# EAGLE schematic analogue-board (EAGLE 7.7.0)

## Sheet 1 of 2
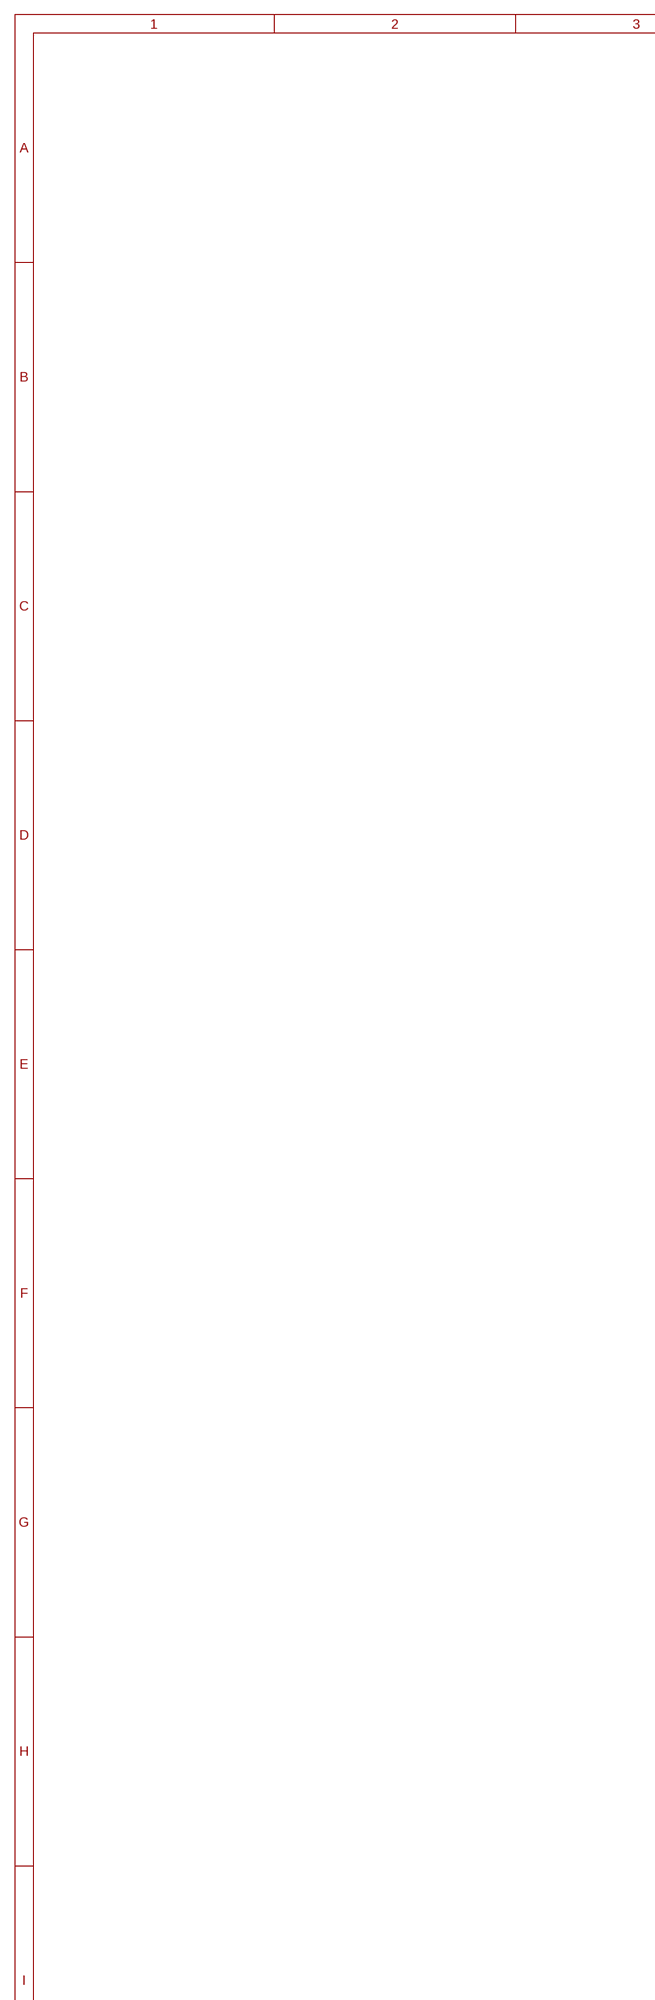
[diagram p0: schematic, sheet 1, part 1 of 2]
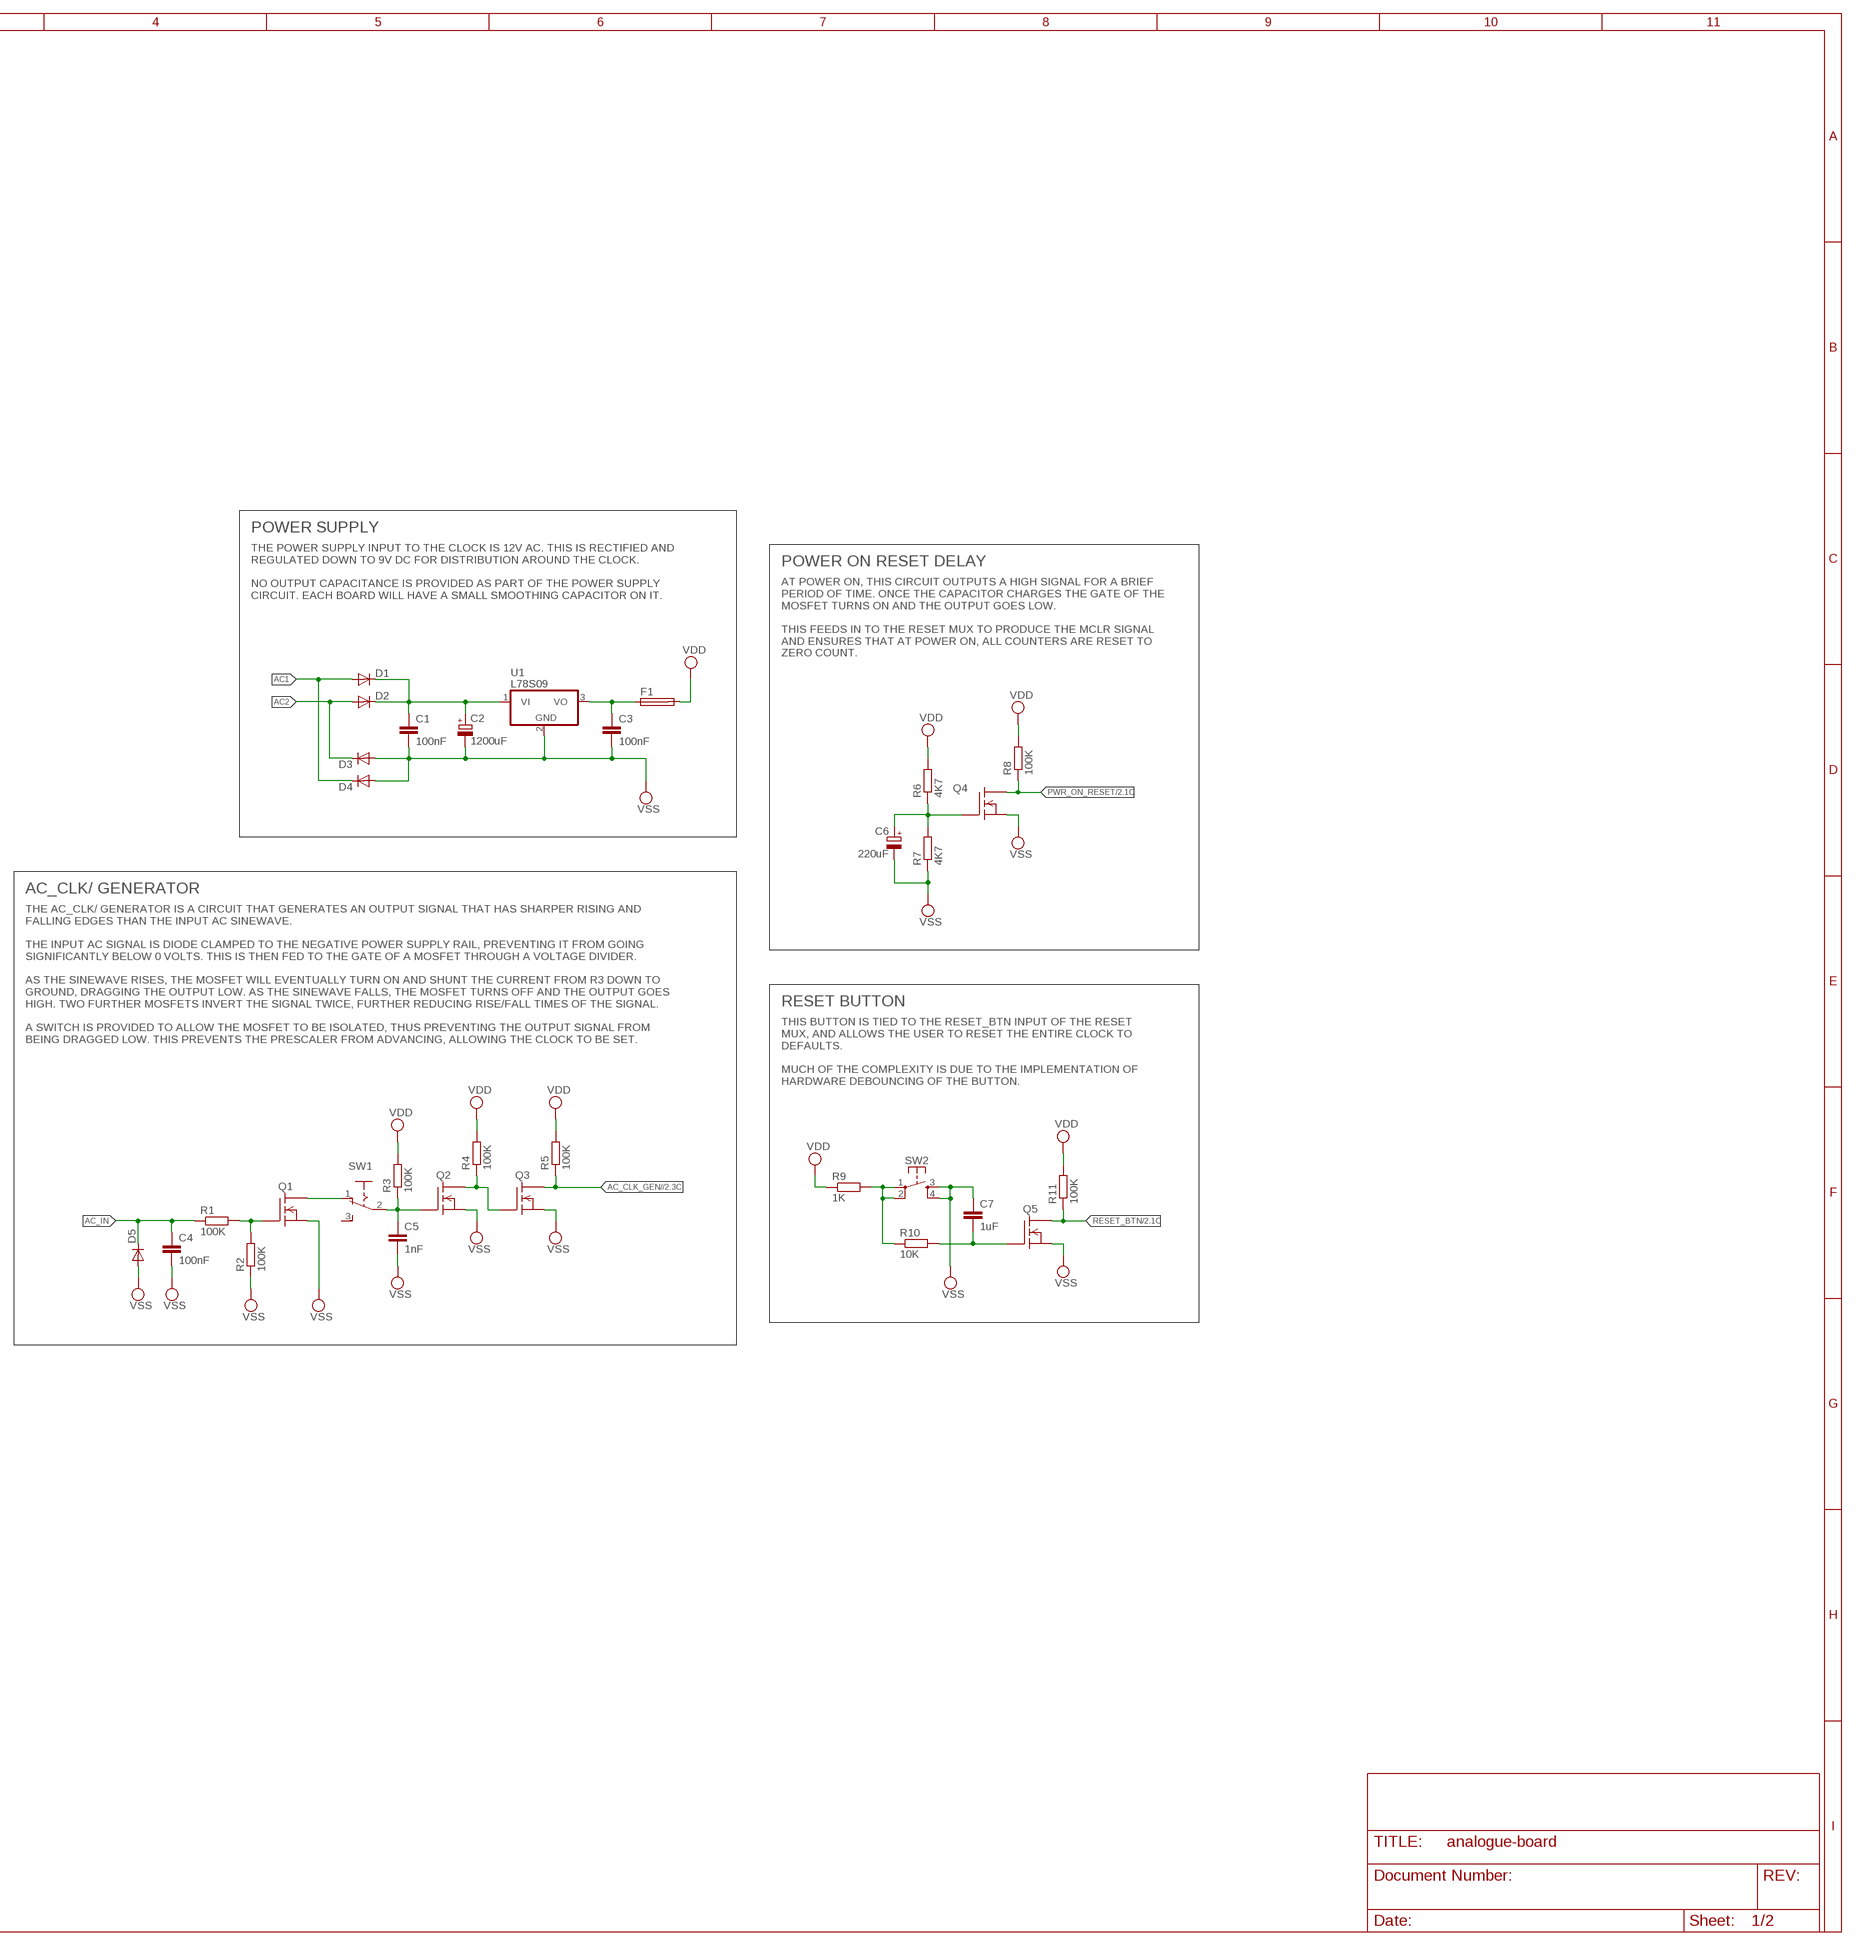
[diagram p1: schematic, sheet 1, part 2 of 2]

### Parts
C1  100nF  C-EU050-024X044  [C050-024X044]
C2  1200uF  CPOL-EUE7.5-16  [E7,5-16]
C3  100nF  C-EU050-024X044  [C050-024X044]
C4  100nF  C-EU050-024X044  [C050-024X044]
C5  1nF  C-EU050-025X075  [C050-025X075]
C6  220uF  CPOL-EUE2.5-6  [E2,5-6]
C7  1uF  C-EU050-025X075  [C050-025X075]
D1  1N4004  [DO41-10]
D2  1N4004  [DO41-10]
D3  1N4004  [DO41-10]
D4  1N4004  [DO41-10]
D5  1N4004  [DO41-10]
F1  TE5  [TE5]
Q1  2N7000  [TO-92]
Q2  2N7000  [TO-92]
Q3  2N7000  [TO-92]
Q4  2N7000  [TO-92]
Q5  2N7000  [TO-92]
R1  100K  R-EU_0207/2V  [0207/2V]
R2  100K  R-EU_0207/2V  [0207/2V]
R3  100K  R-EU_0207/2V  [0207/2V]
R4  100K  R-EU_0207/2V  [0207/2V]
R5  100K  R-EU_0207/2V  [0207/2V]
R6  4K7  R-EU_0207/2V  [0207/2V]
R7  4K7  R-EU_0207/2V  [0207/2V]
R8  100K  R-EU_0207/2V  [0207/2V]
R9  1K  R-EU_0207/2V  [0207/2V]
R10  10K  R-EU_0207/2V  [0207/2V]
R11  100K  R-EU_0207/2V  [0207/2V]
SW1  255SB  [255SB]
SW2  SPST-TACSWITCH  [TE-SMD-TACSWITCH]
U1  L78S09  7805T  [TO220H]

### Nets
AC1: D1.A D4.C
AC2: D2.A D3.C
AC_CLK_GEN/: Q3.3(D) R5.1 ; also sheet 2
AC_IN: C4.1 D5.C R1.1
N$1: C5.1 Q2.2(G) R3.1 SW1.2(P)
N$3: C6.+ Q4.2(G) R6.1 R7.2
N$4: C3.1 F1.1 U1.3(VO)
N$11: C1.1 C2.+ D1.C D2.C U1.1(VI)
N$12: R9.2 R10.1 SW2.1 SW2.2
N$13: Q2.3(D) Q3.2(G) R4.1
N$14: Q1.2(G) R1.2 R2.2
N$15: C7.2 Q5.2(G) R10.2
N$16: Q1.3(D) SW1.1(O)
PWR_ON_RESET: Q4.3(D) R8.1 ; also sheet 2
RESET_BTN: Q5.3(D) R11.1 ; also sheet 2
VDD: F1.2 R3.2 R4.2 R5.2 R6.2 R8.2 R9.1 R11.2 ; also sheet 2
VSS: C1.2 C2.- C3.2 C4.2 C5.2 C6.- C7.1 D3.A D4.A D5.A Q1.1(S) Q2.1(S) Q3.1(S) Q4.1(S) Q5.1(S) R2.1 R7.1 SW2.3 SW2.4 U1.2(GND) ; also sheet 2
Unconnected: SW1.3(S)

### Notes on the sheet
- POWER SUPPLY
- THE POWER SUPPLY INPUT TO THE CLOCK IS 12V AC. THIS IS RECTIFIED AND
  REGULATED DOWN TO 9V DC FOR DISTRIBUTION AROUND THE CLOCK.
  
  NO OUTPUT CAPACITANCE IS PROVIDED AS PART OF THE POWER SUPPLY
  CIRCUIT. EACH BOARD WILL HAVE A SMALL SMOOTHING CAPACITOR ON IT.
- POWER ON RESET DELAY
- AT POWER ON, THIS CIRCUIT OUTPUTS A HIGH SIGNAL FOR A BRIEF
  PERIOD OF TIME. ONCE THE CAPACITOR CHARGES THE GATE OF THE
  MOSFET TURNS ON AND THE OUTPUT GOES LOW.
  
  THIS FEEDS IN TO THE RESET MUX TO PRODUCE THE MCLR SIGNAL
  AND ENSURES THAT AT POWER ON, ALL COUNTERS ARE RESET TO
  ZERO COUNT.
- AC_CLK/ GENERATOR
- THE AC_CLK/ GENERATOR IS A CIRCUIT THAT GENERATES AN OUTPUT SIGNAL THAT HAS SHARPER RISING AND
  FALLING EDGES THAN THE INPUT AC SINEWAVE.
  
  THE INPUT AC SIGNAL IS DIODE CLAMPED TO THE NEGATIVE POWER SUPPLY RAIL, PREVENTING IT FROM GOING
  SIGNIFICANTLY BELOW 0 VOLTS. THIS IS THEN FED TO THE GATE OF A MOSFET THROUGH A VOLTAGE DIVIDER.
  
  AS THE SINEWAVE RISES, THE MOSFET WILL EVENTUALLY TURN ON AND SHUNT THE CURRENT FROM R3 DOWN TO
  GROUND, DRAGGING THE OUTPUT LOW. AS THE SINEWAVE FALLS, THE MOSFET TURNS OFF AND THE OUTPUT GOES
  HIGH. TWO FURTHER MOSFETS INVERT THE SIGNAL TWICE, FURTHER REDUCING RISE/FALL TIMES OF THE SIGNAL.
  
  A SWITCH IS PROVIDED TO ALLOW THE MOSFET TO BE ISOLATED, THUS PREVENTING THE OUTPUT SIGNAL FROM
  BEING DRAGGED LOW. THIS PREVENTS THE PRESCALER FROM ADVANCING, ALLOWING THE CLOCK TO BE SET.
- RESET BUTTON
- THIS BUTTON IS TIED TO THE RESET_BTN INPUT OF THE RESET
  MUX, AND ALLOWS THE USER TO RESET THE ENTIRE CLOCK TO
  DEFAULTS.
  
  MUCH OF THE COMPLEXITY IS DUE TO THE IMPLEMENTATION OF
  HARDWARE DEBOUNCING OF THE BUTTON.

## Sheet 2 of 2
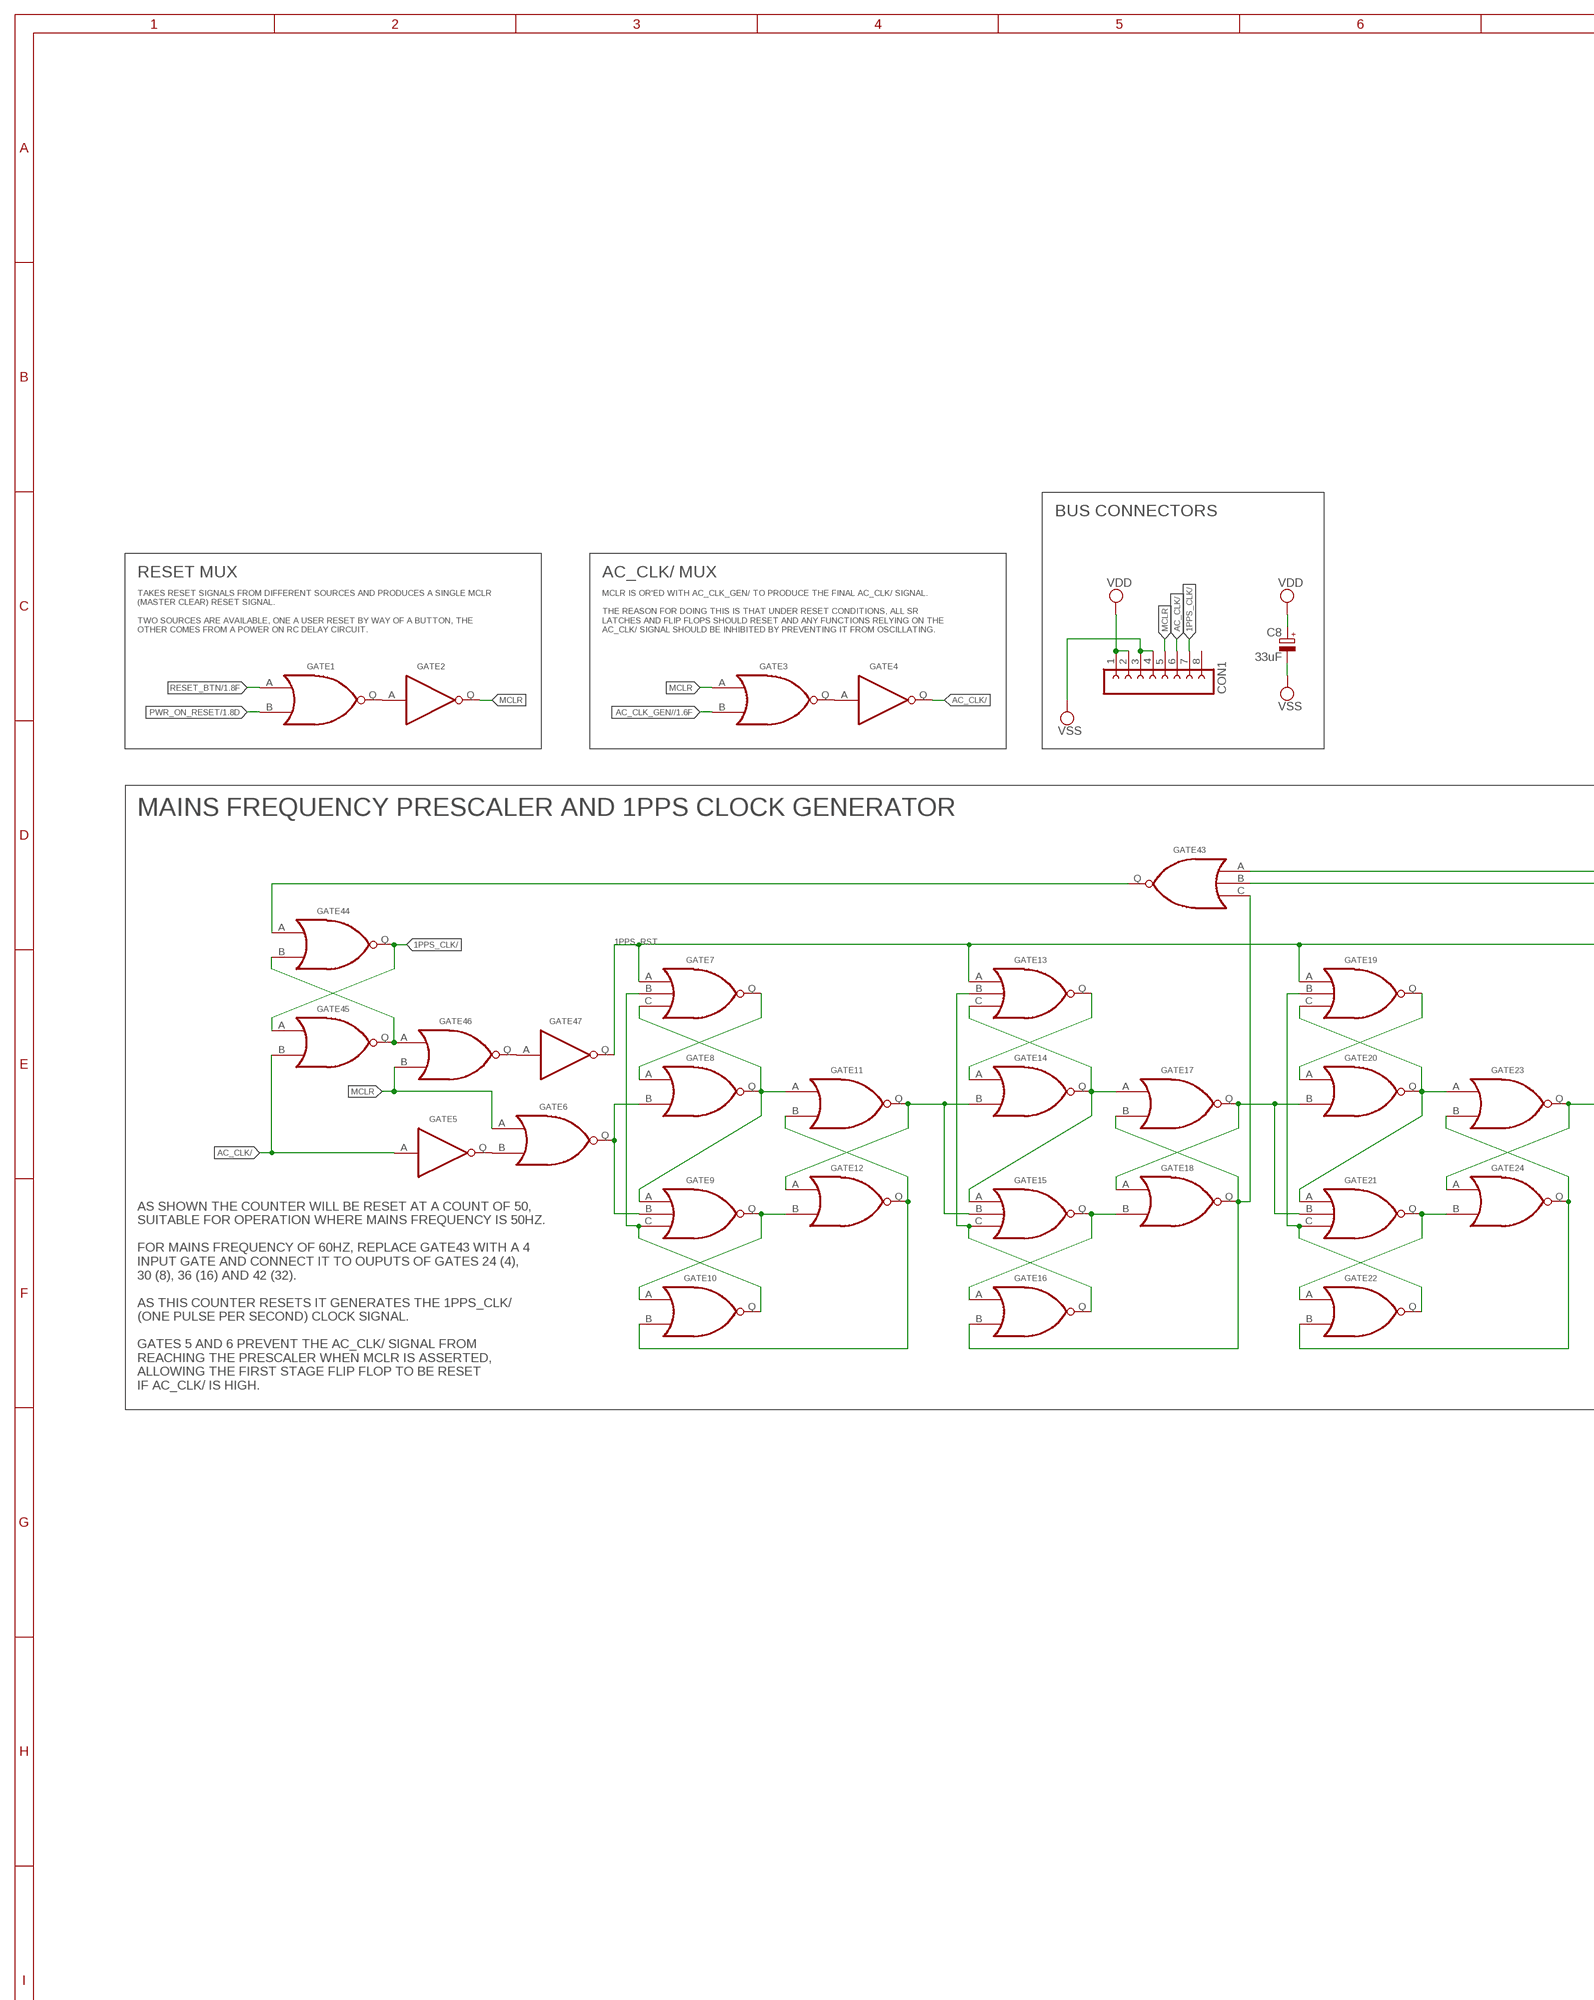
[diagram p2: schematic, sheet 2, part 1 of 2]
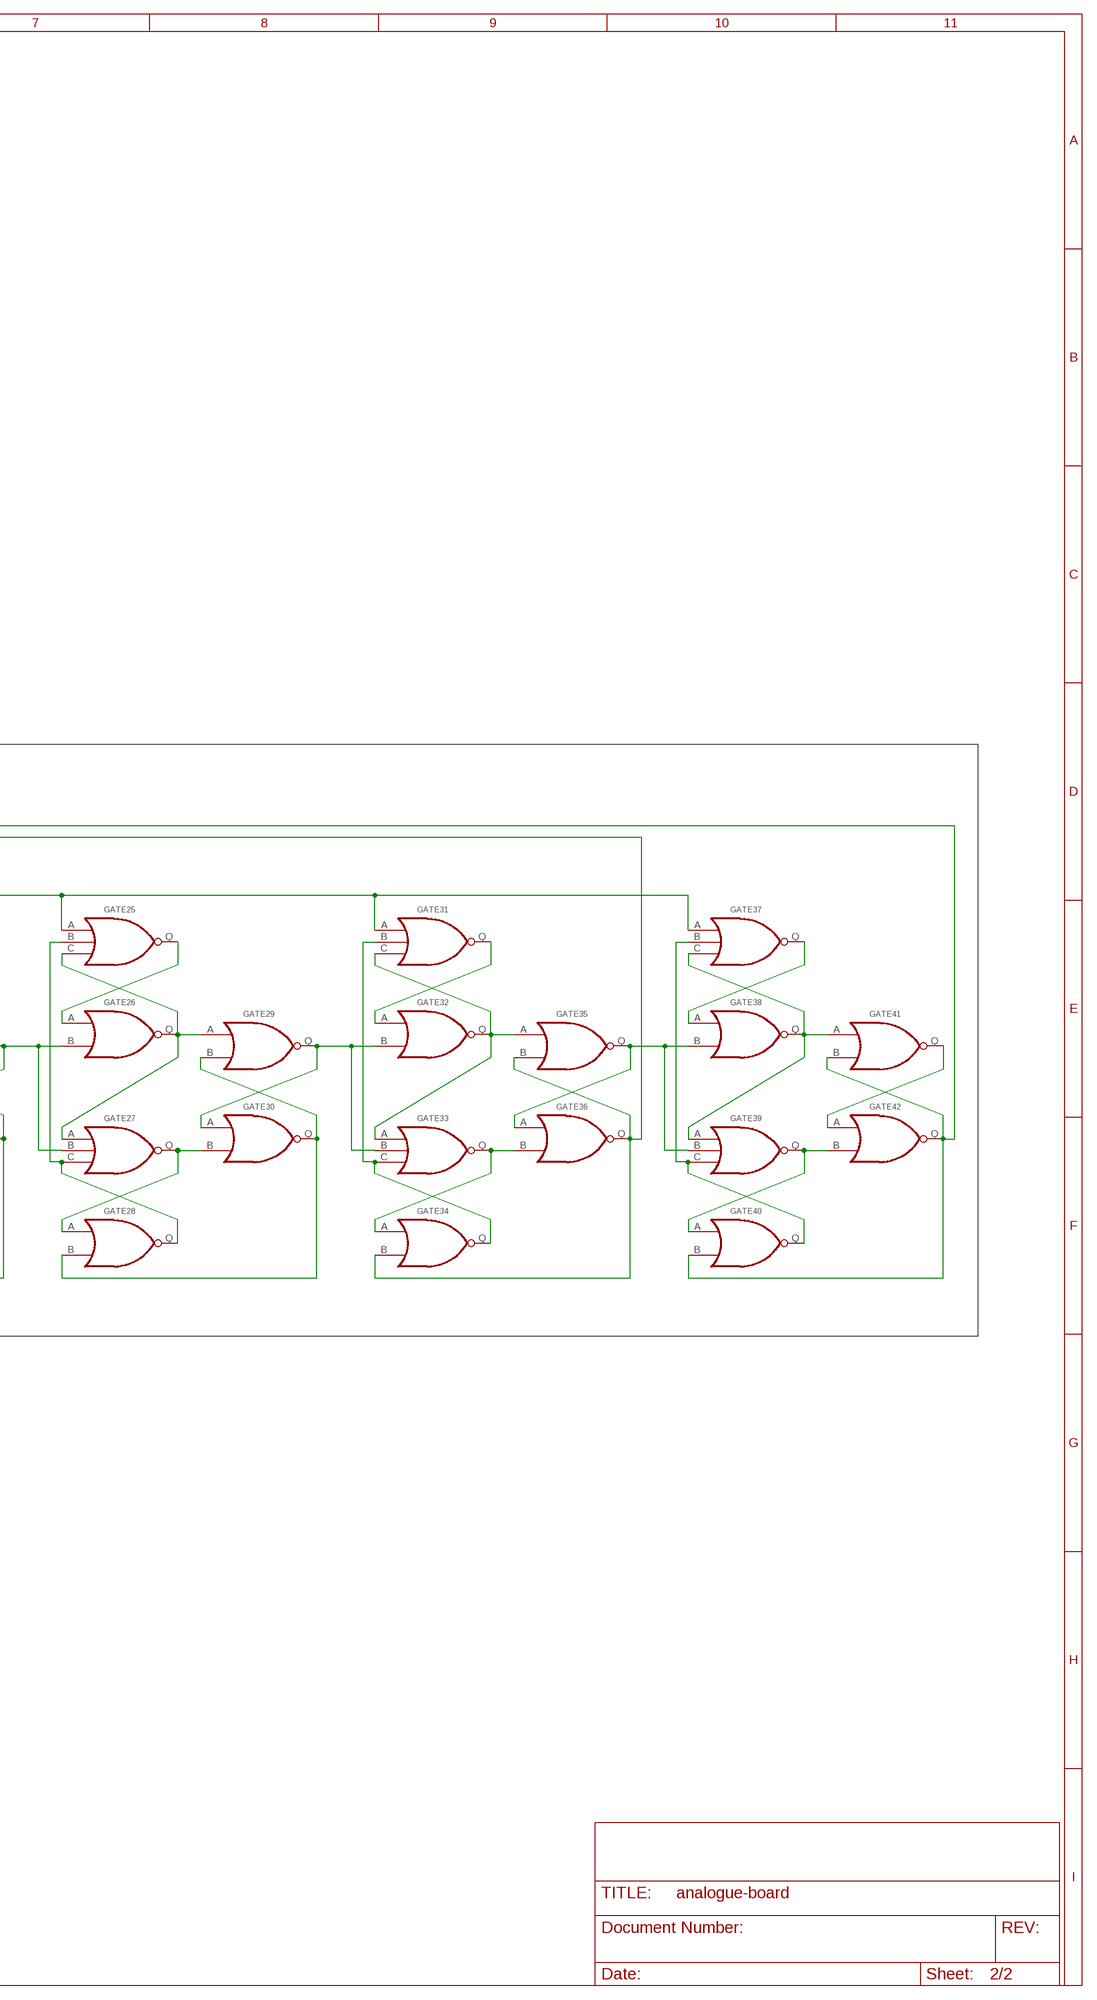
[diagram p3: schematic, sheet 2, part 2 of 2]

### Parts
C8  33uF  CPOL-EUE2.5-6  [E2,5-6]
CON1  FE08-1  [FE08]
GATE1  2NOR  [2NOR]
GATE2  INVERTER  [INVERTER]
GATE3  2NOR  [2NOR]
GATE4  INVERTER  [INVERTER]
GATE5  INVERTER  [INVERTER]
GATE6  2NOR  [2NOR]
GATE7  3NOR  [3NOR]
GATE8  2NOR  [2NOR]
GATE9  3NOR  [3NOR]
GATE10  2NOR  [2NOR]
GATE11  2NOR  [2NOR]
GATE12  2NOR  [2NOR]
GATE13  3NOR  [3NOR]
GATE14  2NOR  [2NOR]
GATE15  3NOR  [3NOR]
GATE16  2NOR  [2NOR]
GATE17  2NOR  [2NOR]
GATE18  2NOR  [2NOR]
GATE19  3NOR  [3NOR]
GATE20  2NOR  [2NOR]
GATE21  3NOR  [3NOR]
GATE22  2NOR  [2NOR]
GATE23  2NOR  [2NOR]
GATE24  2NOR  [2NOR]
GATE25  3NOR  [3NOR]
GATE26  2NOR  [2NOR]
GATE27  3NOR  [3NOR]
GATE28  2NOR  [2NOR]
GATE29  2NOR  [2NOR]
GATE30  2NOR  [2NOR]
GATE31  3NOR  [3NOR]
GATE32  2NOR  [2NOR]
GATE33  3NOR  [3NOR]
GATE34  2NOR  [2NOR]
GATE35  2NOR  [2NOR]
GATE36  2NOR  [2NOR]
GATE37  3NOR  [3NOR]
GATE38  2NOR  [2NOR]
GATE39  3NOR  [3NOR]
GATE40  2NOR  [2NOR]
GATE41  2NOR  [2NOR]
GATE42  2NOR  [2NOR]
GATE43  3NOR  [3NOR]
GATE44  2NOR  [2NOR]
GATE45  2NOR  [2NOR]
GATE46  2NOR  [2NOR]
GATE47  INVERTER  [INVERTER]

### Nets
1PPS_CLK/: CON1.7 GATE44.Q GATE45.A
1PPS_RST: GATE7.A GATE13.A GATE19.A GATE25.A GATE31.A GATE37.A GATE47.Q
AC_CLK/: CON1.6 GATE4.Q GATE5.A GATE45.B
AC_CLK_GEN/: GATE3.B ; also sheet 1
MCLR: CON1.5 GATE2.Q GATE3.A GATE6.A GATE46.B
N$5: GATE1.Q GATE2.A
N$6: GATE44.B GATE45.Q GATE46.A
N$7: GATE3.Q GATE4.A
N$8: GATE6.Q GATE8.B GATE9.B
N$9: GATE5.Q GATE6.B
N$10: GATE46.Q GATE47.A
N$18: GATE35.Q GATE36.A GATE38.B GATE39.B
N$23: GATE7.C GATE8.Q GATE9.A GATE11.A
N$30: GATE7.Q GATE8.A
N$35: GATE7.B GATE9.C GATE10.Q
N$37: GATE9.Q GATE10.A GATE12.B
N$38: GATE10.B GATE11.B GATE12.Q
N$42: GATE11.Q GATE12.A GATE14.B GATE15.B
N$46: GATE13.C GATE14.Q GATE15.A GATE17.A
N$47: GATE13.Q GATE14.A
N$49: GATE13.B GATE15.C GATE16.Q
N$50: GATE15.Q GATE16.A GATE18.B
N$51: GATE16.B GATE17.B GATE18.Q GATE43.C
N$52: GATE17.Q GATE18.A GATE20.B GATE21.B
N$53: GATE19.C GATE20.Q GATE21.A GATE23.A
N$54: GATE19.Q GATE20.A
N$55: GATE19.B GATE21.C GATE22.Q
N$56: GATE21.Q GATE22.A GATE24.B
N$57: GATE22.B GATE23.B GATE24.Q
N$58: GATE23.Q GATE24.A GATE26.B GATE27.B
N$59: GATE25.C GATE26.Q GATE27.A GATE29.A
N$60: GATE25.Q GATE26.A
N$61: GATE25.B GATE27.C GATE28.Q
N$62: GATE27.Q GATE28.A GATE30.B
N$63: GATE28.B GATE29.B GATE30.Q
N$64: GATE41.Q GATE42.A
N$65: GATE31.C GATE32.Q GATE33.A GATE35.A
N$66: GATE31.Q GATE32.A
N$67: GATE31.B GATE33.C GATE34.Q
N$68: GATE33.Q GATE34.A GATE36.B
N$69: GATE34.B GATE35.B GATE36.Q GATE43.B
N$70: GATE43.Q GATE44.A
N$71: GATE37.C GATE38.Q GATE39.A GATE41.A
N$72: GATE37.Q GATE38.A
N$73: GATE37.B GATE39.C GATE40.Q
N$74: GATE39.Q GATE40.A GATE42.B
N$75: GATE40.B GATE41.B GATE42.Q GATE43.A
N$80: GATE29.Q GATE30.A GATE32.B GATE33.B
PWR_ON_RESET: GATE1.B ; also sheet 1
RESET_BTN: GATE1.A ; also sheet 1
VDD: C8.+ CON1.1 CON1.2 ; also sheet 1
VSS: C8.- CON1.3 CON1.4 ; also sheet 1
Unconnected: CON1.8

### Notes on the sheet
- BUS CONNECTORS
- RESET MUX | AC_CLK/ MUX
- TAKES RESET SIGNALS FROM DIFFERENT SOURCES AND PRODUCES A SINGLE MCLR
  (MASTER CLEAR) RESET SIGNAL.
  
  TWO SOURCES ARE AVAILABLE, ONE A USER RESET BY WAY OF A BUTTON, THE
  OTHER COMES FROM A POWER ON RC DELAY CIRCUIT.
- MCLR IS OR'ED WITH AC_CLK_GEN/ TO PRODUCE THE FINAL AC_CLK/ SIGNAL.
  
  THE REASON FOR DOING THIS IS THAT UNDER RESET CONDITIONS, ALL SR
  LATCHES AND FLIP FLOPS SHOULD RESET AND ANY FUNCTIONS RELYING ON THE
  AC_CLK/ SIGNAL SHOULD BE INHIBITED BY PREVENTING IT FROM OSCILLATING.
- MAINS FREQUENCY PRESCALER AND 1PPS CLOCK GENERATOR
- AS SHOWN THE COUNTER WILL BE RESET AT A COUNT OF 50,
  SUITABLE FOR OPERATION WHERE MAINS FREQUENCY IS 50HZ.
  
  FOR MAINS FREQUENCY OF 60HZ, REPLACE GATE43 WITH A 4
  INPUT GATE AND CONNECT IT TO OUPUTS OF GATES 24 (4),
  30 (8), 36 (16) AND 42 (32).
  
  AS THIS COUNTER RESETS IT GENERATES THE 1PPS_CLK/
  (ONE PULSE PER SECOND) CLOCK SIGNAL.
  
  GATES 5 AND 6 PREVENT THE AC_CLK/ SIGNAL FROM
  REACHING THE PRESCALER WHEN MCLR IS ASSERTED,
  ALLOWING THE FIRST STAGE FLIP FLOP TO BE RESET
  IF AC_CLK/ IS HIGH.

## Library data of the parts
C1 C3-C5 C7 = rcl:C-EU: CAPACITOR, European symbol
C2 C6 C8 = rcl:CPOL-EU: POLARIZED CAPACITOR, European symbol
CON1 = con-lsta:FE08-1: FEMALE HEADER; OC_FARNELL: unknown; OC_NEWARK: unknown
D1-D5 = diode:1N4004: DIODE general purpose rectifier, 1 A
F1 = fuse:TE5: FUSE Wickmann; OC_FARNELL: unknown; OC_NEWARK: unknown
GATE1 GATE3 GATE6 GATE8 GATE10-GATE12 GATE14 GATE16-GATE18 GATE20 GATE22-GATE24 GATE26 GATE28-GATE30 GATE32 GATE34-GATE36 GATE38 GATE40-GATE42 GATE44-GATE46 = NOR gate clock:2NOR
GATE2 GATE4 GATE5 GATE47 = NOR gate clock:INVERTER
GATE7 GATE9 GATE13 GATE15 GATE19 GATE21 GATE25 GATE27 GATE31 GATE33 GATE37 GATE39 GATE43 = NOR gate clock:3NOR
Q1-Q5 = NOR gate clock:2N7000
R1-R11 = NOR gate clock:R-EU_
SW1 = switch:255SB: SLIDING SWITCH Distributor Buerklin, 11G810
SW2 = Toms Library:SPST-TACSWITCH: TE SPST normally-open tactile switch. MPN: 4-1437565-1 Rating: 0.05A @ 12V
U1 = linear:78*: Positive VOLTAGE REGULATOR Source: http://cache.national.com/ds/LM/LM78L05.pdf http://www.fairchildsemi.com/ds/LM/LM7805.pdf